# Altium schematic sheet ESP32.SchDoc
size A4; SheetNumber: 3; SheetTotal: 7
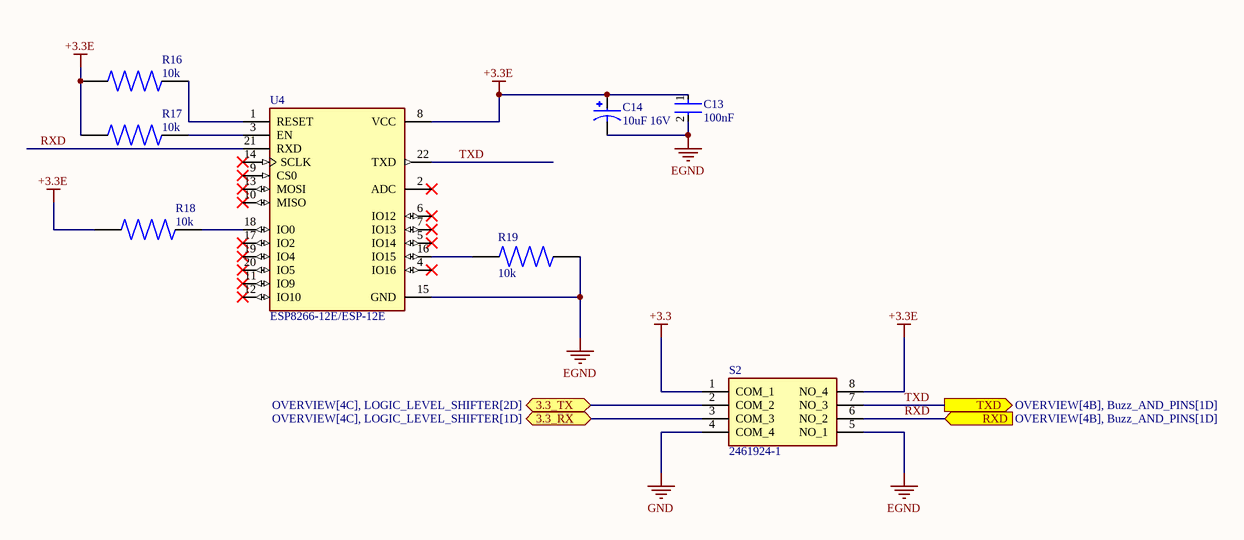
[diagram p0: ESP32.SchDoc]

## Parts
C13  100nF  [FP-GRT31C-0_2-MFG]
C14  10uF 16V  [CAP_EEEHB1C100AR]
R16  10k  [RESC3115X65N]
R17  10k  [RESC3115X65N]
R18  10k  [RESC3115X65N]
R19  10k  [RESC3115X65N]
S2  2461924-1  [24619241]
U4  ESP8266-12E/ESP-12E  [XCVR_ESP8266-12E/ESP-12E]

## Ports
3.3_RX (bidir, see OVERVIEW[4C], LOGIC_LEVEL_SHIFTER[1D]), 3.3_TX (bidir, see OVERVIEW[4C], LOGIC_LEVEL_SHIFTER[2D]), RXD (in, see OVERVIEW[4B], Buzz_AND_PINS[1D]), TXD (out, see OVERVIEW[4B], Buzz_AND_PINS[1D])

## Nets
+3.3: S2.1(COM_1)
+3.3E: C13.1 C14.1 R16.1 R17.1 R18.1 S2.8(NO_4) U4.8(VCC)
EGND: C13.2 C14.2 R19.2 S2.5(NO_1) U4.15(GND)
GND: S2.4(COM_4)
3.3_RX: S2.3(COM_3) ; port 3.3_RX
3.3_TX: S2.2(COM_2) ; port 3.3_TX
RXD: S2.6(NO_2) U4.21(RXD) ; port RXD
TXD: S2.7(NO_3) U4.22(TXD) ; port TXD
NetR16_2: R16.2 U4.1(RESET)
NetR17_2: R17.2 U4.3(EN)
NetR18_2: R18.2 U4.18(IO0)
NetR19_1: R19.1 U4.16(IO15)

Not connected (* = marked no-connect by the designer): U4 2(ADC)* 4(IO16)* 5(IO14)* 6(IO12)* 7(IO13)* 9(CS0)* 10(MISO)* 11(IO9)* 12(IO10)* 13(MOSI)* 14(SCLK)* 17(IO2)* 19(IO4)* 20(IO5)*

## Library data of the parts
C13 = CMP-06035-012780-1: Multi-Layer Ceramic Capacitor 100nF 50V C0G ±1% 1206 Emboss T/R
C14 = EEEHB1C100AR: 10ÂµF 16V Aluminum Electrolytic Capacitors Radial, Can - SMD 2000 Hrs @ 105Â°C; MP: EEE-HB1C100AR; MF: Panasonic; SnapEDA_Link: https://www.snapeda.com/parts/EEE-HB1C100AR/Panasonic/view-part/?ref=snap; Availability: In Stock; Purchase-URL: https://pricing.snapeda.com/search/part/EEE-HB1C100AR/?ref=eda; Price: None; Check_prices: https://www.snapeda.com/parts/EEE-HB1C100AR/Panasonic/view-part/?ref=eda; Value: *; Package: RADIAL-2 Panasonic
R16-R19 = CRG1206F4K7/10: Res Thick Film 1206 4.7K Ohm 1% 0.25W(1/4W) Â±100ppm/C Pad SMD T/R; Power_Rating: .25 W; MF: TE Connectivity; Voltage_Rating: 200 V; SnapEDA_Link: https://www.snapeda.com/parts/CRG1206F4K7/10/TE+Connectivity/view-part/?ref=snap; Package: 1206; Resistance: 4.7K; Value: *; MP: CRG1206F4K7/10; EU_RoHS_Compliance: Compliant with Exemptions; Tolerance: 1%; Check_prices: https://www.snapeda.com/parts/CRG1206F4K7/10/TE+Connectivity/view-part/?ref=eda
S2 = 2461924-1: Switch; Manufacturer_Name: TE Connectivity; Datasheet Link: https://www.te.com/commerce/DocumentDelivery/DDEController?Action=showdoc&DocId=Customer+Drawing%7F2461924%7F1%7Fpdf%7FEnglish%7FENG_CD_2461924_1.pdf%7F2461924-1; Height: 3.96mm; Manufacturer_Part_Number: 2461924-1; Mouser Part Number: 655-2461924-1; Mouser Price/Stock: https://www.mouser.co.uk/ProductDetail/TE-Connectivity-Alcoswitch/2461924-1?qs=1Kr7Jg1SGW%2FU7%2FCcD7QPxQ%3D%3D
U4 = ESP8266-12E/ESP-12E: This WiFi module has a 32-bit MCU micro and clock speeds supporting 80 MHz or 160 MHz. Supports the RTOS and integrated Wi-Fi MAC/BB/RF/PA/LNA, and has an on-board antenna.; MF: AI-Thinker; Value: *; SnapEDA_Link: https://www.snapeda.com/parts/ESP8266-12E/ESP-12E/AI-Thinker/view-part/?ref=snap; Availability: Not in stock; Price: None; Package: None; Check_prices: https://www.snapeda.com/parts/ESP8266-12E/ESP-12E/AI-Thinker/view-part/?ref=eda; MP: ESP8266-12E/ESP-12E